# Altium schematic sheet Supply.SchDoc
size 594 x 420 mm; SheetNumber: 3; SheetTotal: 7; SPICEModelCacheTXXMBLSN: <root> / <DocumentId>TXXMBLSN</DocumentId> / <CacheFrame Number="0"> / <Model Name="led2" Kind="MDL"> / <Text>*Typ RED,GREEN,YELLOW,AMBER GaAs LED: Vf=2.1V Vr=4V If=40mA trr=3uS / *LED Pinout: 1=A, 2=K / .MODEL LED2 D (IS=93.1P RS=42M N=4.61 BV=4 IBV=10U / + CJO=2.97P VJ=.75 M=.333 TT=4.32U)</Text> / </Model> / <Model Name="fuse" Kind="CKT"> / <Text>.SUBCKT FUSE 1 2 PARAMS: CURRENT=1 RESISTANCE=1m / SW1 1 2 3 0 SMOD OFF / BNLV 3 0 V=(abs(v(1,2))) / .MODEL SMOD SW (VT={(CURRENT*RESISTANCE)} RON=1g ROFF={RESISTANCE}) / .ENDS FUSE</Text> / </Model> / </CacheFrame> / </root>
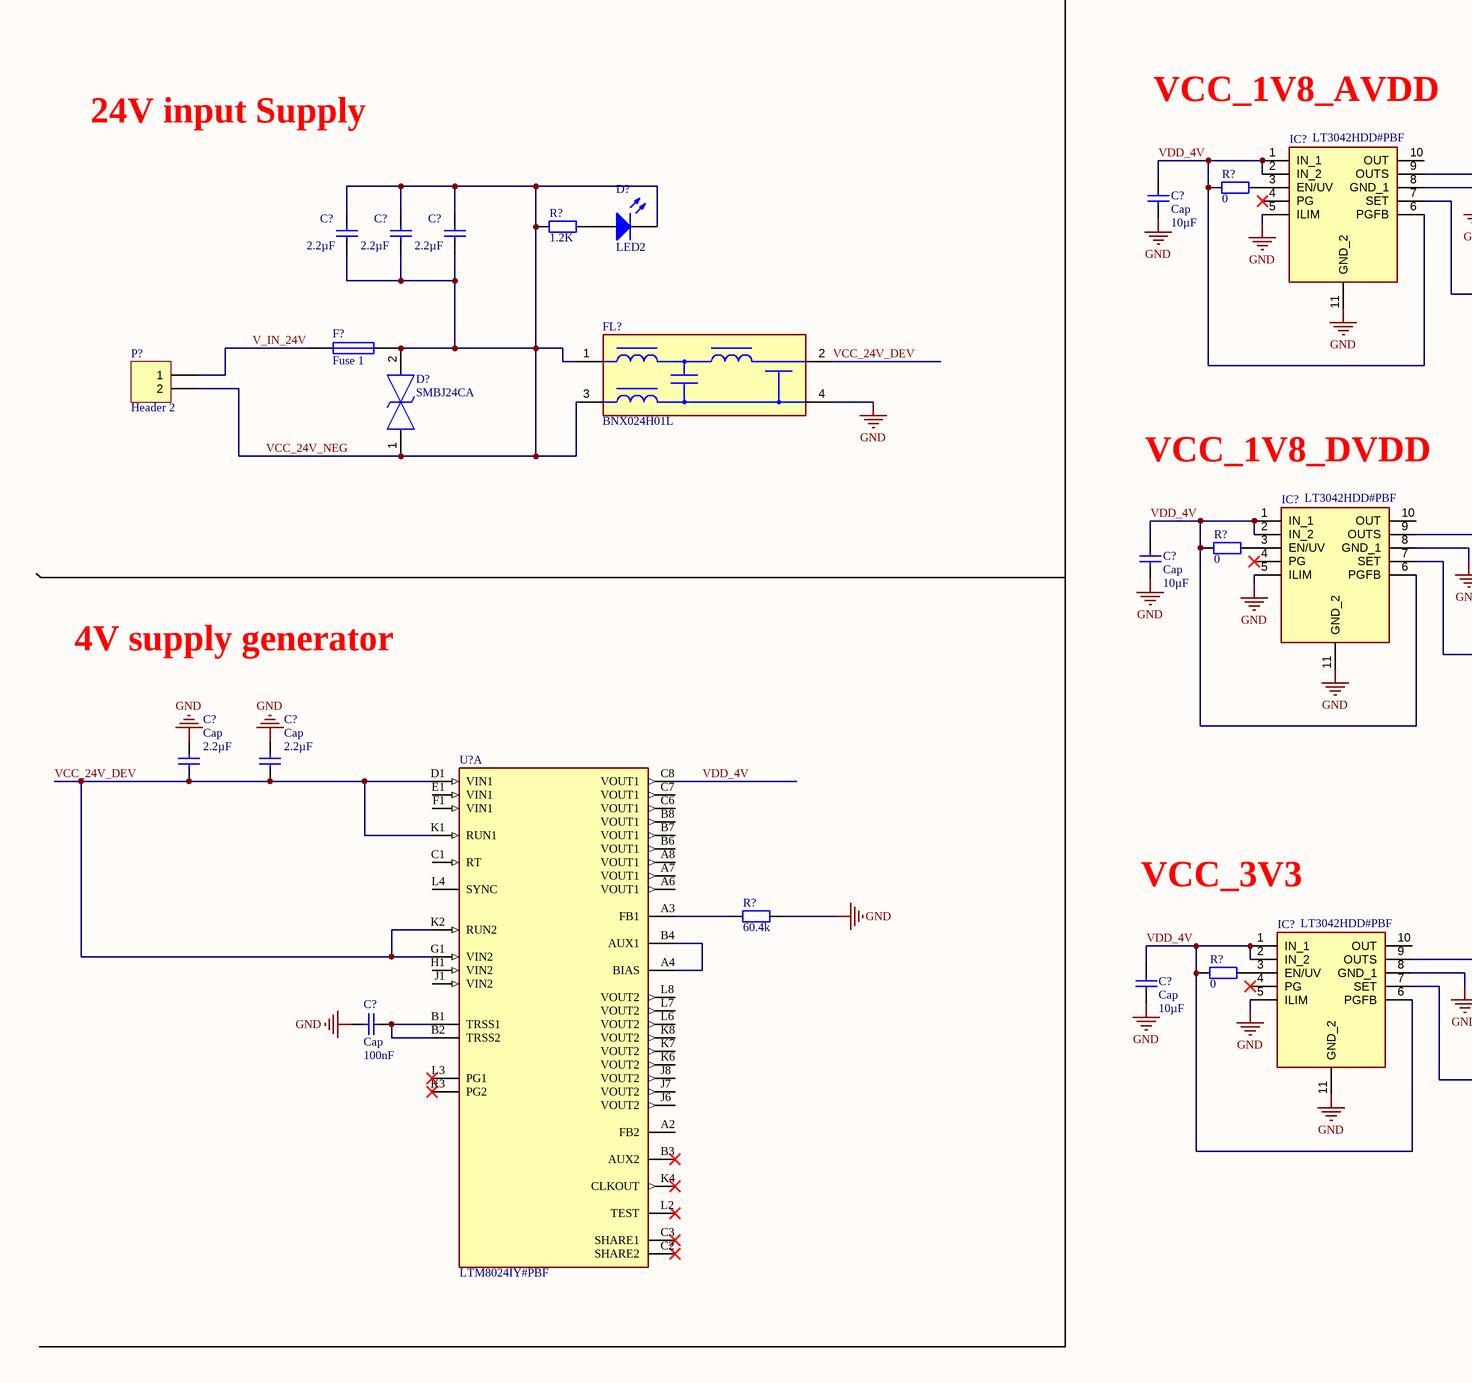
[diagram p0: Supply.SchDoc, left]
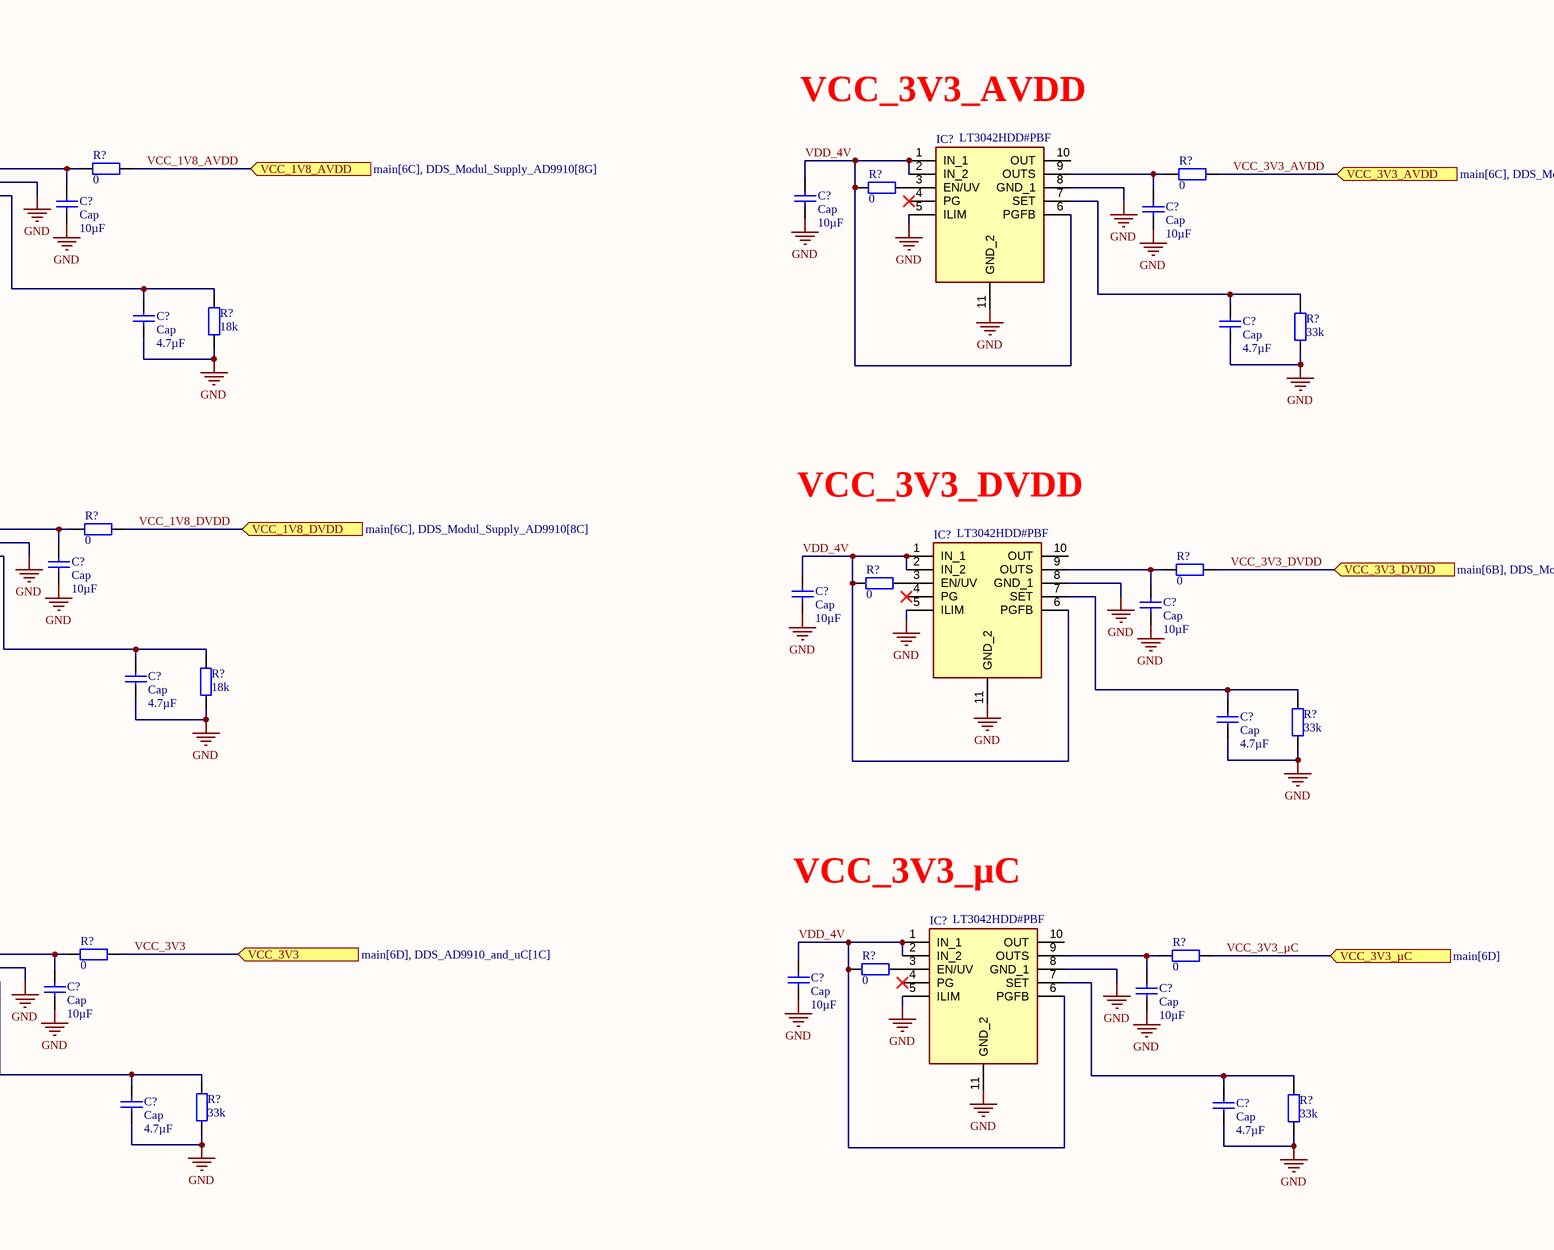
[diagram p1: Supply.SchDoc, right]

## Parts
(Parts that share a designator on the sheet are numbered #1, #2 ... from top to bottom, then left to right.)
C?#1  Cap  value 10µF  [RAD-0.3]
C?#2  Cap  value 10µF  [RAD-0.3]
C?#3  Cap  value 10µF  [RAD-0.3]
C?#4  Cap  value 10µF  [RAD-0.3]
C?#5  value 2.2µF  [RAD-0.3]  (hidden comment: Cap)
C?#6  value 2.2µF  [RAD-0.3]  (hidden comment: Cap)
C?#7  value 2.2µF  [RAD-0.3]  (hidden comment: Cap)
C?#8  Cap  value 4.7µF  [RAD-0.3]
C?#9  Cap  value 4.7µF  [RAD-0.3]
C?#10  Cap  value 10µF  [RAD-0.3]
C?#11  Cap  value 10µF  [RAD-0.3]
C?#12  Cap  value 10µF  [RAD-0.3]
C?#13  Cap  value 10µF  [RAD-0.3]
C?#14  Cap  value 4.7µF  [RAD-0.3]
C?#15  Cap  value 4.7µF  [RAD-0.3]
C?#16  Cap  value 2.2µF  [RAD-0.3]
C?#17  Cap  value 2.2µF  [RAD-0.3]
C?#18  Cap  value 10µF  [RAD-0.3]
C?#19  Cap  value 10µF  [RAD-0.3]
C?#20  Cap  value 10µF  [RAD-0.3]
C?#21  Cap  value 10µF  [RAD-0.3]
C?#22  Cap  value 100nF  [RAD-0.3]
C?#23  Cap  value 4.7µF  [RAD-0.3]
C?#24  Cap  value 4.7µF  [RAD-0.3]
D?#1  LED2  [3.2X1.6X1.1]
D?#2  SMBJ24CA  [SMBJ50CA]
F?  Fuse 1  [PIN-W2/E2.8]
FL?  BNX024H01L  [FP-BNX02-MFG]
IC?#1  LT3042HDD#PBF  [SON50P300X300X80-11N-D]
IC?#2  LT3042HDD#PBF  [SON50P300X300X80-11N-D]
IC?#3  LT3042HDD#PBF  [SON50P300X300X80-11N-D]
IC?#4  LT3042HDD#PBF  [SON50P300X300X80-11N-D]
IC?#5  LT3042HDD#PBF  [SON50P300X300X80-11N-D]
IC?#6  LT3042HDD#PBF  [SON50P300X300X80-11N-D]
P?  Header 2  [HDR1X2]
R?#1  value 0  [AXIAL-0.4]
R?#2  value 0  [AXIAL-0.4]
R?#3  value 0  [AXIAL-0.4]
R?#4  value 0  [AXIAL-0.4]
R?#5  value 1.2K  [AXIAL-0.4]
R?#6  value 18k  [AXIAL-0.4]
R?#7  value 33k  [AXIAL-0.4]
R?#8  value 0  [AXIAL-0.4]
R?#9  value 0  [AXIAL-0.4]
R?#10  value 0  [AXIAL-0.4]
R?#11  value 0  [AXIAL-0.4]
R?#12  value 18k  [AXIAL-0.4]
R?#13  value 33k  [AXIAL-0.4]
R?#14  value 60.4k  [AXIAL-0.4]
R?#15  value 0  [AXIAL-0.4]
R?#16  value 0  [AXIAL-0.4]
R?#17  value 0  [AXIAL-0.4]
R?#18  value 0  [AXIAL-0.4]
R?#19  value 33k  [AXIAL-0.4]
R?#20  value 33k  [AXIAL-0.4]
U?  LTM8024IY#PBF  [FP-BGA-88-05-08-1535-MFG]  (part A of 2)

## Ports
VCC_1V8_AVDD (in, see main[6C], DDS_Modul_Supply_AD9910[8G]), VCC_1V8_DVDD (in, see main[6C], DDS_Modul_Supply_AD9910[8C]), VCC_3V3 (in, see main[6D], DDS_AD9910_and_uC[1C]), VCC_3V3_AVDD (in, see main[6C], DDS_Modul_Supply_AD9910[8D]), VCC_3V3_DVDD (in, see main[6B], DDS_Modul_Supply_AD9910[8B]), VCC_3V3_µC (in, see main[6D])

## Nets
GND: C?#1.1 C?#2.1 C?#3.1 C?#4.1 C?#8.1 C?#9.1 C?#10.1 C?#11.1 C?#12.1 C?#13.1 C?#14.1 C?#15.1 C?#16.2 C?#17.2 C?#18.1 C?#19.1 C?#20.1 C?#21.1 C?#22.2 C?#23.1 C?#24.1 FL?.4(CG) IC?#1.5(ILIM) IC?#1.8(GND_1) IC?#1.11(GND_2) IC?#2.5(ILIM) IC?#2.8(GND_1) IC?#2.11(GND_2) IC?#3.5(ILIM) IC?#3.8(GND_1) IC?#3.11(GND_2) IC?#4.5(ILIM) IC?#4.8(GND_1) IC?#4.11(GND_2) IC?#5.5(ILIM) IC?#5.8(GND_1) IC?#5.11(GND_2) IC?#6.5(ILIM) IC?#6.8(GND_1) IC?#6.11(GND_2) R?#6.1 R?#7.1 R?#12.1 R?#13.1 R?#14.2 R?#19.1 R?#20.1
V_IN_24V: F?.1 P?.1
VCC_1V8_AVDD: R?#1.2 ; port VCC_1V8_AVDD
VCC_1V8_DVDD: R?#8.2 ; port VCC_1V8_DVDD
VCC_3V3: R?#15.2 ; port VCC_3V3
VCC_3V3_AVDD: R?#2.2 ; port VCC_3V3_AVDD
VCC_3V3_DVDD: R?#10.2 ; port VCC_3V3_DVDD
VCC_3V3_µC: R?#16.2 ; port VCC_3V3_µC
VCC_24V_DEV: C?#16.1 C?#17.1 FL?.2(CB) U?.D1(VIN1) U?.G1(VIN2) U?.K1(RUN1) U?.K2(RUN2)
VCC_24V_NEG: C?#5.1 C?#5.2 C?#6.1 C?#6.2 C?#7.1 C?#7.2 D?#1.2(K) D?#2.1 D?#2.2 F?.2 FL?.1(B) FL?.3(PSG) P?.2 R?#5.1
VDD_4V: C?#1.2 C?#2.2 C?#10.2 C?#12.2 C?#18.2 C?#19.2 IC?#1.1(IN_1) IC?#1.2(IN_2) IC?#1.6(PGFB) IC?#2.1(IN_1) IC?#2.2(IN_2) IC?#2.6(PGFB) IC?#3.1(IN_1) IC?#3.2(IN_2) IC?#3.6(PGFB) IC?#4.1(IN_1) IC?#4.2(IN_2) IC?#4.6(PGFB) IC?#5.1(IN_1) IC?#5.2(IN_2) IC?#5.6(PGFB) IC?#6.1(IN_1) IC?#6.2(IN_2) IC?#6.6(PGFB) R?#3.1 R?#4.1 R?#9.1 R?#11.1 R?#17.1 R?#18.1 U?.C8(VOUT1)
NetC?#3_2: C?#3.2 IC?#1.9(OUTS) R?#1.1
NetC?#4_2: C?#4.2 IC?#2.9(OUTS) R?#2.1
NetC?#8_2: C?#8.2 IC?#1.7(SET) R?#6.2
NetC?#9_2: C?#9.2 IC?#2.7(SET) R?#7.2
NetC?#11_2: C?#11.2 IC?#3.9(OUTS) R?#8.1
NetC?#13_2: C?#13.2 IC?#4.9(OUTS) R?#10.1
NetC?#14_2: C?#14.2 IC?#3.7(SET) R?#12.2
NetC?#15_2: C?#15.2 IC?#4.7(SET) R?#13.2
NetC?#20_2: C?#20.2 IC?#5.9(OUTS) R?#15.1
NetC?#21_2: C?#21.2 IC?#6.9(OUTS) R?#16.1
NetC?#22_1: C?#22.1 U?.B1(TRSS1) U?.B2(TRSS2)
NetC?#23_2: C?#23.2 IC?#5.7(SET) R?#19.2
NetC?#24_2: C?#24.2 IC?#6.7(SET) R?#20.2
NetD?#1_1: D?#1.1(A) R?#5.2
NetIC?#1_3: IC?#1.3(EN/UV) R?#3.2
NetIC?#2_3: IC?#2.3(EN/UV) R?#4.2
NetIC?#3_3: IC?#3.3(EN/UV) R?#9.2
NetIC?#4_3: IC?#4.3(EN/UV) R?#11.2
NetIC?#5_3: IC?#5.3(EN/UV) R?#17.2
NetIC?#6_3: IC?#6.3(EN/UV) R?#18.2
NetR?#14_1: R?#14.1 U?.A3(FB1)
NetU?_A4: U?.A4(BIAS) U?.B4(AUX1)

Not connected (* = marked no-connect by the designer): IC?#1 4(PG)* 10(OUT); IC?#2 4(PG)* 10(OUT); IC?#3 4(PG)* 10(OUT); IC?#4 4(PG)* 10(OUT); IC?#5 4(PG)* 10(OUT); IC?#6 4(PG)* 10(OUT); U? A2(FB2) A6(VOUT1) A7(VOUT1) A8(VOUT1) B3(AUX2)* B6(VOUT1) B7(VOUT1) B8(VOUT1) C1(RT) C2(SHARE2)* C3(SHARE1)* C6(VOUT1) C7(VOUT1) E1(VIN1) F1(VIN1) H1(VIN2) J1(VIN2) J6(VOUT2) J7(VOUT2) J8(VOUT2) K3(PG2)* K4(CLKOUT)* K6(VOUT2) K7(VOUT2) K8(VOUT2) L2(TEST)* L3(PG1)* L4(SYNC) L6(VOUT2) L7(VOUT2) L8(VOUT2)

## Notes on the sheet
- 24V input Supply
- VCC_1V8_AVDD
- VCC_3V3_AVDD
- VCC_1V8_DVDD
- VCC_3V3_DVDD
- 4V supply generator
- VCC_3V3
- VCC_3V3_µC
- DWG NO:
- REV:
- THIS DOCUMENT AND THE DATA DISCLOSED HEREIN OR
- HEREWITH IS THE PROPERTY OF ALTIUM LIMITED AND MAY
- BE FREELY DISTRIBUTED IN WHOLE. NO RIGHTS ARE
- RESERVED OR EXPRESS OR IMPLIED WARANTEE GIVEN.
- REVISION
- DESCRIPTION
- DATE
- APPROVED
- ENG:
- APPROVALS
- PROJECT
- DSN:
- CHK:
- REFERENCE DOCUMENTS
- PROJECT REVISION:
- TITLE
- DOCUMENT REVISION:
- DESIGN ITEM:
- BOM:
- FAB DWG:
- PCB DWG:
- ASSY DWG:
- SCALE:
- A2
- SIZE
- CAGE CODE
- FILE NAME
- DWG NO.
- SHEET
- OF
- REV

## Library data of the parts
C?#1-C?#24 = Cap: Capacitor; Published: 8-Jun-2000; LatestRevisionDate: 17-Jul-2002; LatestRevisionNote: Re-released for DXP Platform.; PackageReference: RAD-0.3; Publisher: Altium Limited; PackageDescription: Radial Cap, Thru-Hole; 2 Leads; 0.3 in Pin Spacing
D?#1 = LED2: Typical RED, GREEN, YELLOW, AMBER GaAs LED; Published: 8-Jun-2000; LatestRevisionDate: 17-Jul-2002; LatestRevisionNote: Re-released for DXP Platform.; PackageVersion: Feb-2002; PackageReference: 3.2X1.6X1.1; Publisher: Altium Limited; PackageDescription: SM LED; 2 Flat Leads
D?#2 = SMBJ24CA: TVS Diode (Bi-directional); Manufacturer_Name: STMicroelectronics; Datasheet Link: http://www.st.com/web/en/resource/technical/document/datasheet/CD00001366.pdf; Height: 2.65mm; Manufacturer_Part_Number: SMBJ24CA
F? = Fuse 1: Fuse; Published: 8-Jun-2000; LatestRevisionDate: 17-Jul-2002; LatestRevisionNote: Re-released for DXP Platform.; PackageReference: PIN-W2/E2.8; Publisher: Altium Limited; PackageDescription: Thru-Hole; 2 Leads
FL? = CMP-06051-000263-1: Block Type Emi Filter, SMD6, 4.7uF, 20A, 100VDC; Attenuation Value: 35dB; Current Rating: 15A; ESD Protection: No; Max Voltage Rating (DC): 50V; Number of Channels: 2; Impedance: 50R; Operating Frequency: 100 kHz ? 1 GHz; Frequency: 100kHz; Termination: Flat; Lead Free: Lead Free; Depth: 9.1mm; Max Current Rating: 15A; Circuit Type: Filter; Radiation Hardening: No; Packaging: Tape and Reel; Voltage Rating: 50V; Max Operating Temperature: 125°C; Length: 12.1mm; Case/Package: SMD/SMT; Package Quantity: 1; Height: 0.146inch; Capacitance: 4.7uF; REACH SVHC: No SVHC; Mount: Surface Mount; RoHS Compliant: Yes; Series: EMIFIL®, BNX02*H; Voltage Rating (DC): 50V; Current: 15A; Min Operating Temperature: -55°C; Width: 9.1mm
IC?#1-IC?#6 = LT3042HDD#PBF: Integrated Circuit; Manufacturer_Name: Analog Devices; Datasheet Link: https://datasheet.datasheetarchive.com/originals/distributors/DKDS-14/269629.pdf; Height: 0.8mm; Manufacturer_Part_Number: LT3042HDD#PBF; Mouser Part Number: 584-LT3042HDD#PBF; Mouser Price/Stock: https://www.mouser.co.uk/ProductDetail/Analog-Devices-Linear-Technology/LT3042HDDPBF?qs=oahfZPh6IAKXR%252BCYz0F0Vw%3D%3D; Arrow Part Number: LT3042HDD#PBF; Arrow Price/Stock: https://www.arrow.com/en/products/lt3042hddpbf/analog-devices?region=nac
P? = Header 2: Header, 2-Pin; LatestRevisionDate: 17-Jul-2002; LatestRevisionNote: Re-released for DXP Platform.; Publisher: Altium Limited
R?#1-R?#20 = Res2: Resistor; Published: 8-Jun-2000; LatestRevisionDate: 17-Jul-2002; LatestRevisionNote: Re-released for DXP Platform.; PackageReference: AXIAL-0.4; Publisher: Altium Limited; PackageDescription: Axial Device, Thru-Hole; 2 Leads; 0.4 in Pin Spacing
U? = CMP-09139-000183-1: DC DC CONVERTER 0.8-8V 0.8-8V